# EAGLE schematic schematic_v1 (EAGLE 9.1.3)
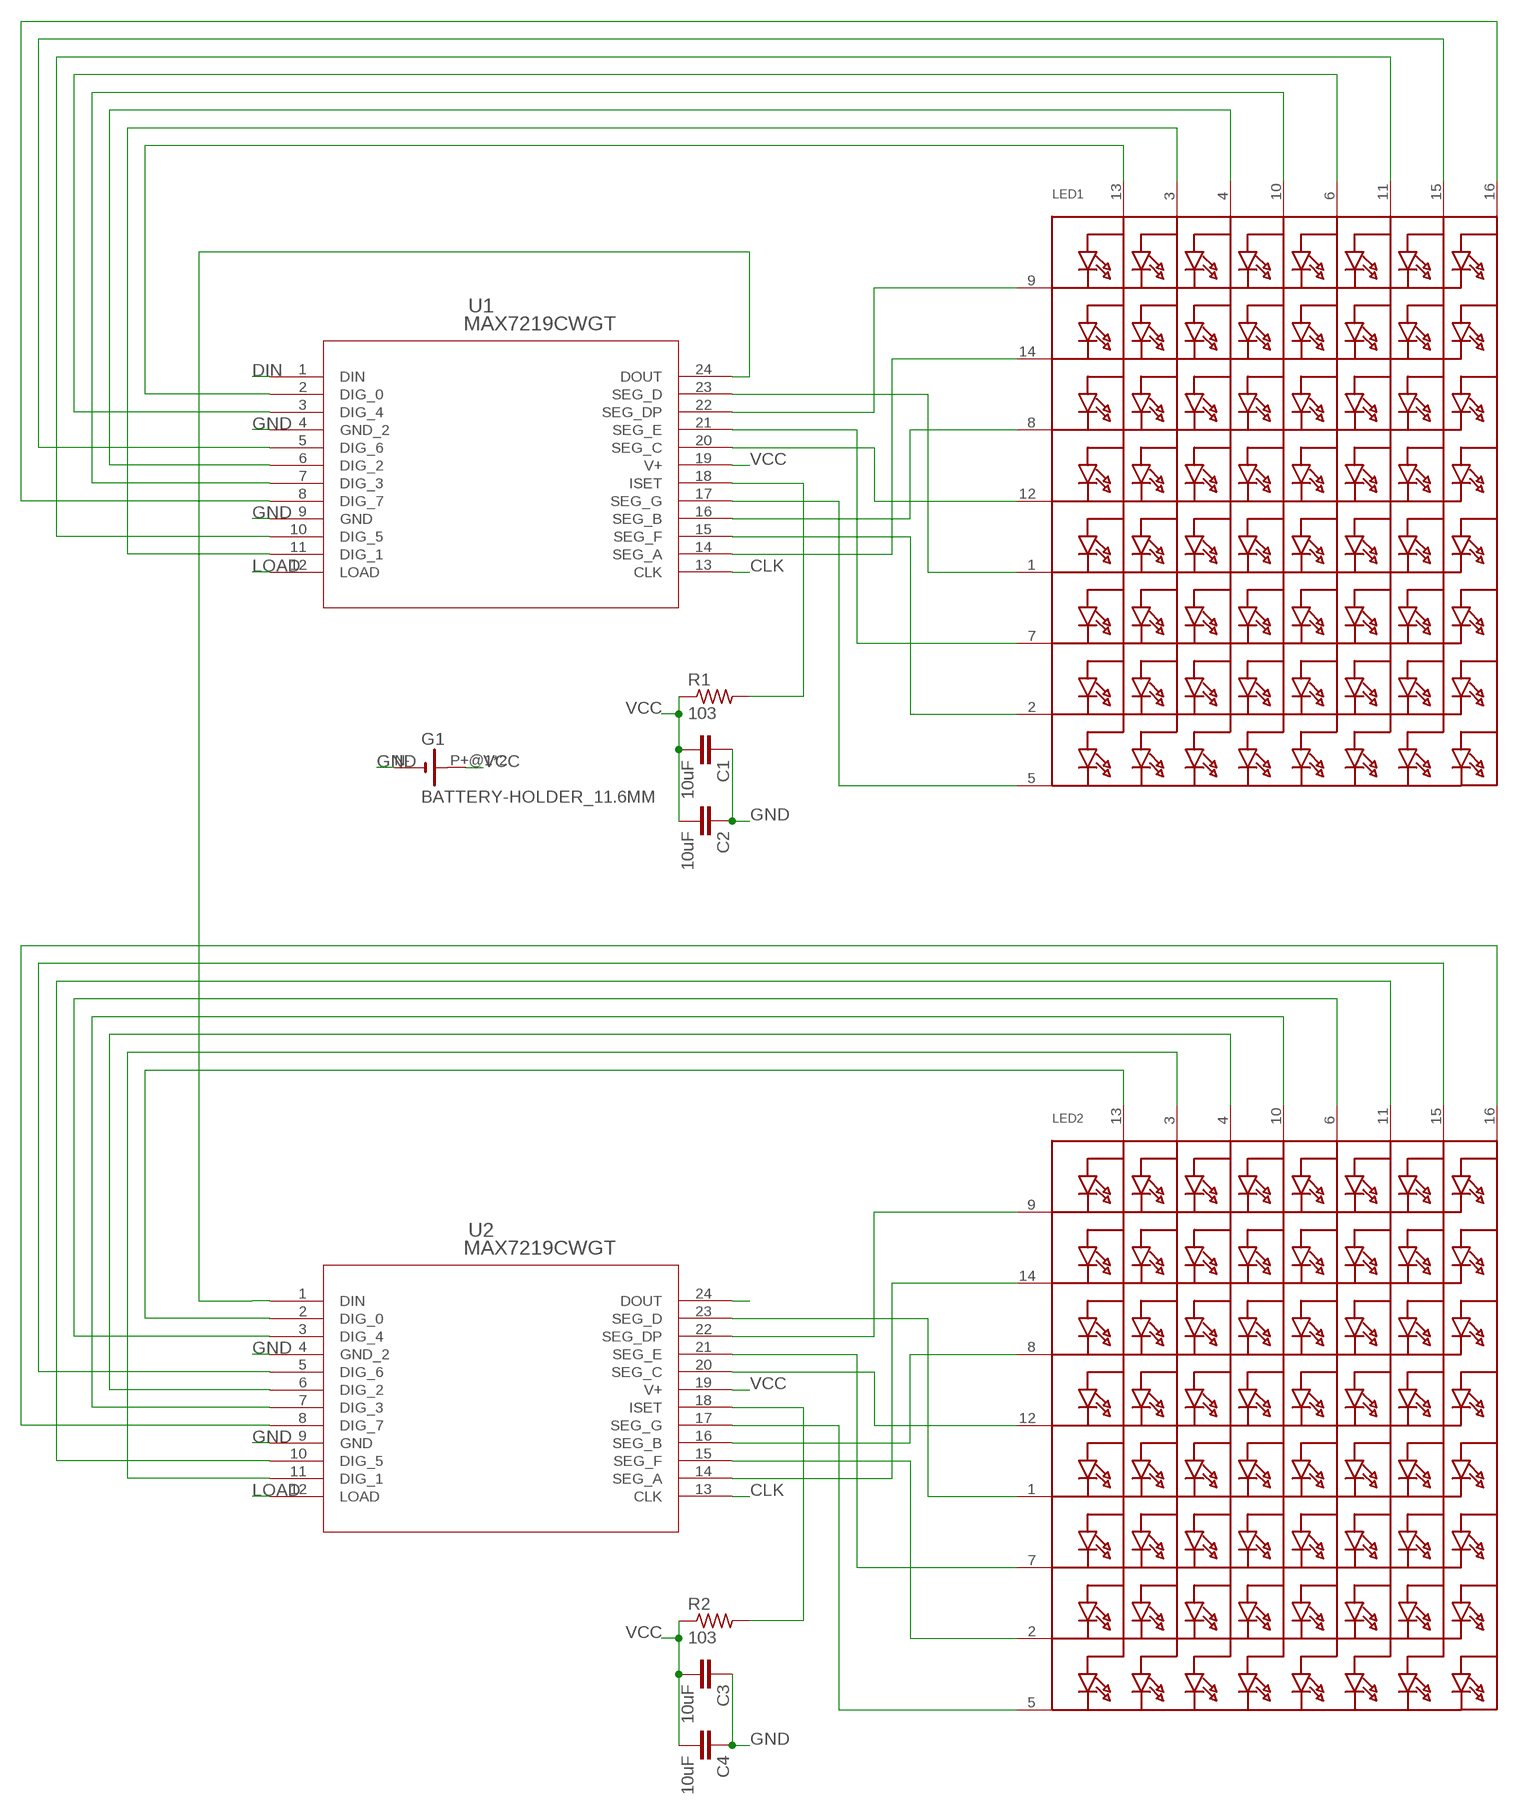
[diagram p0: schematic, sheet 1]

## Parts
C1  10uF  10UF-0805-10V-10%  [0805]
C2  10uF  10UF-0805-10V-10%  [0805]
C3  10uF  10UF-0805-10V-10%  [0805]
C4  10uF  10UF-0805-10V-10%  [0805]
G1  BATTERY-HOLDER_11.6MM  [CELL_RETAINER_11.6MM]
LED1  SEGMENT_8X8_ROWCATHODEBL-M15  [SEGMENT_BL-M15A881]
LED2  SEGMENT_8X8_ROWCATHODEBL-M15  [SEGMENT_BL-M15A881]
R1  103  R-US_M0805  [M0805]
R2  103  R-US_M0805  [M0805]
U1  MAX7219CWGT  [21-0042B_24]
U2  MAX7219CWGT  [21-0042B_24]

## Nets
CLK: U1.13(CLK) U2.13(CLK)
DIN: U1.1(DIN)
GND: C1.1 C2.1 C3.1 C4.1 G1.N-(-) U1.4(GND_2) U1.9(GND) U2.4(GND_2) U2.9(GND)
LOAD: U1.12(LOAD) U2.12(LOAD)
N$2: LED1.13(A1) U1.2(DIG_0)
N$3: LED1.6(A5) U1.3(DIG_4)
N$5: LED1.15(A7) U1.5(DIG_6)
N$6: LED1.4(A3) U1.6(DIG_2)
N$7: LED1.10(A4) U1.7(DIG_3)
N$8: LED1.16(A8) U1.8(DIG_7)
N$9: LED2.13(A1) U2.2(DIG_0)
N$10: LED1.11(A6) U1.10(DIG_5)
N$11: LED1.3(A2) U1.11(DIG_1)
N$12: LED2.6(A5) U2.3(DIG_4)
N$13: LED1.9(K1) U1.22(SEG_DP)
N$14: LED1.14(K2) U1.14(SEG_A)
N$15: LED1.8(K3) U1.16(SEG_B)
N$16: LED1.12(K4) U1.20(SEG_C)
N$17: LED1.1(K5) U1.23(SEG_D)
N$18: LED1.7(K6) U1.21(SEG_E)
N$19: LED1.2(K7) U1.15(SEG_F)
N$20: LED1.5(K8) U1.17(SEG_G)
N$21: U1.24(DOUT) U2.1(DIN)
N$22: LED2.15(A7) U2.5(DIG_6)
N$23: R1.2 U1.18(ISET)
N$24: LED2.4(A3) U2.6(DIG_2)
N$25: LED2.10(A4) U2.7(DIG_3)
N$26: LED2.16(A8) U2.8(DIG_7)
N$27: LED2.11(A6) U2.10(DIG_5)
N$28: LED2.3(A2) U2.11(DIG_1)
N$29: LED2.9(K1) U2.22(SEG_DP)
N$30: LED2.14(K2) U2.14(SEG_A)
N$31: LED2.8(K3) U2.16(SEG_B)
N$32: LED2.12(K4) U2.20(SEG_C)
N$33: LED2.1(K5) U2.23(SEG_D)
N$34: LED2.7(K6) U2.21(SEG_E)
N$35: LED2.2(K7) U2.15(SEG_F)
N$36: LED2.5(K8) U2.17(SEG_G)
N$37: U2.24(DOUT)
N$38: R2.2 U2.18(ISET)
VCC: C1.2 C2.2 C3.2 C4.2 G1.P+@1(+) G1.P+@2(+) R1.1 R2.1 U1.19(V+) U2.19(V+)

## Library data of the parts
C1-C4 = SparkFun-Capacitors:10UF: 10.0µF ceramic capacitors A capacitor is a passive two-terminal electrical component used to store electrical energy temporarily in an electric field.; PROD_ID: CAP-11330
G1 = battery:BATTERY-HOLDER_11.6MM: 11.6mm PC BUTTON CELL RETAINER, high 5.97mm KEYSTONE ELECTRONICS CORP. Data sheet <http://www.farnell.com/cad/1718310.pdf>; MF: KEYSTONE; MPN: 2997; OC_FARNELL: 2293265
LED1 LED2 = adafruit:SEGMENT_8X8_ROWCATHODE: 8x8 LED Segment Displays: Row = Cathode 0.7" Red 8X8 Matrix, 1.9mm Round LEDs - BL-M07C881UR 1.2" Red 8x8 Matrix, 3.0mm Round LEDs - BL-M12A881UR 1.2" Red 8x8 Matrix, 3.0mm Square LEDs - BL-M12A883
R1 R2 = adafruit:R-US_: RESISTOR, American symbol
U1 U2 = MAX7219CWGT:MAX7219CWGT; MANUFACTURER_PART_NUMBER: max7219cwg+t; VENDOR: MAXIM